# EAGLE schematic MacroBoard (EAGLE 9.6.2)
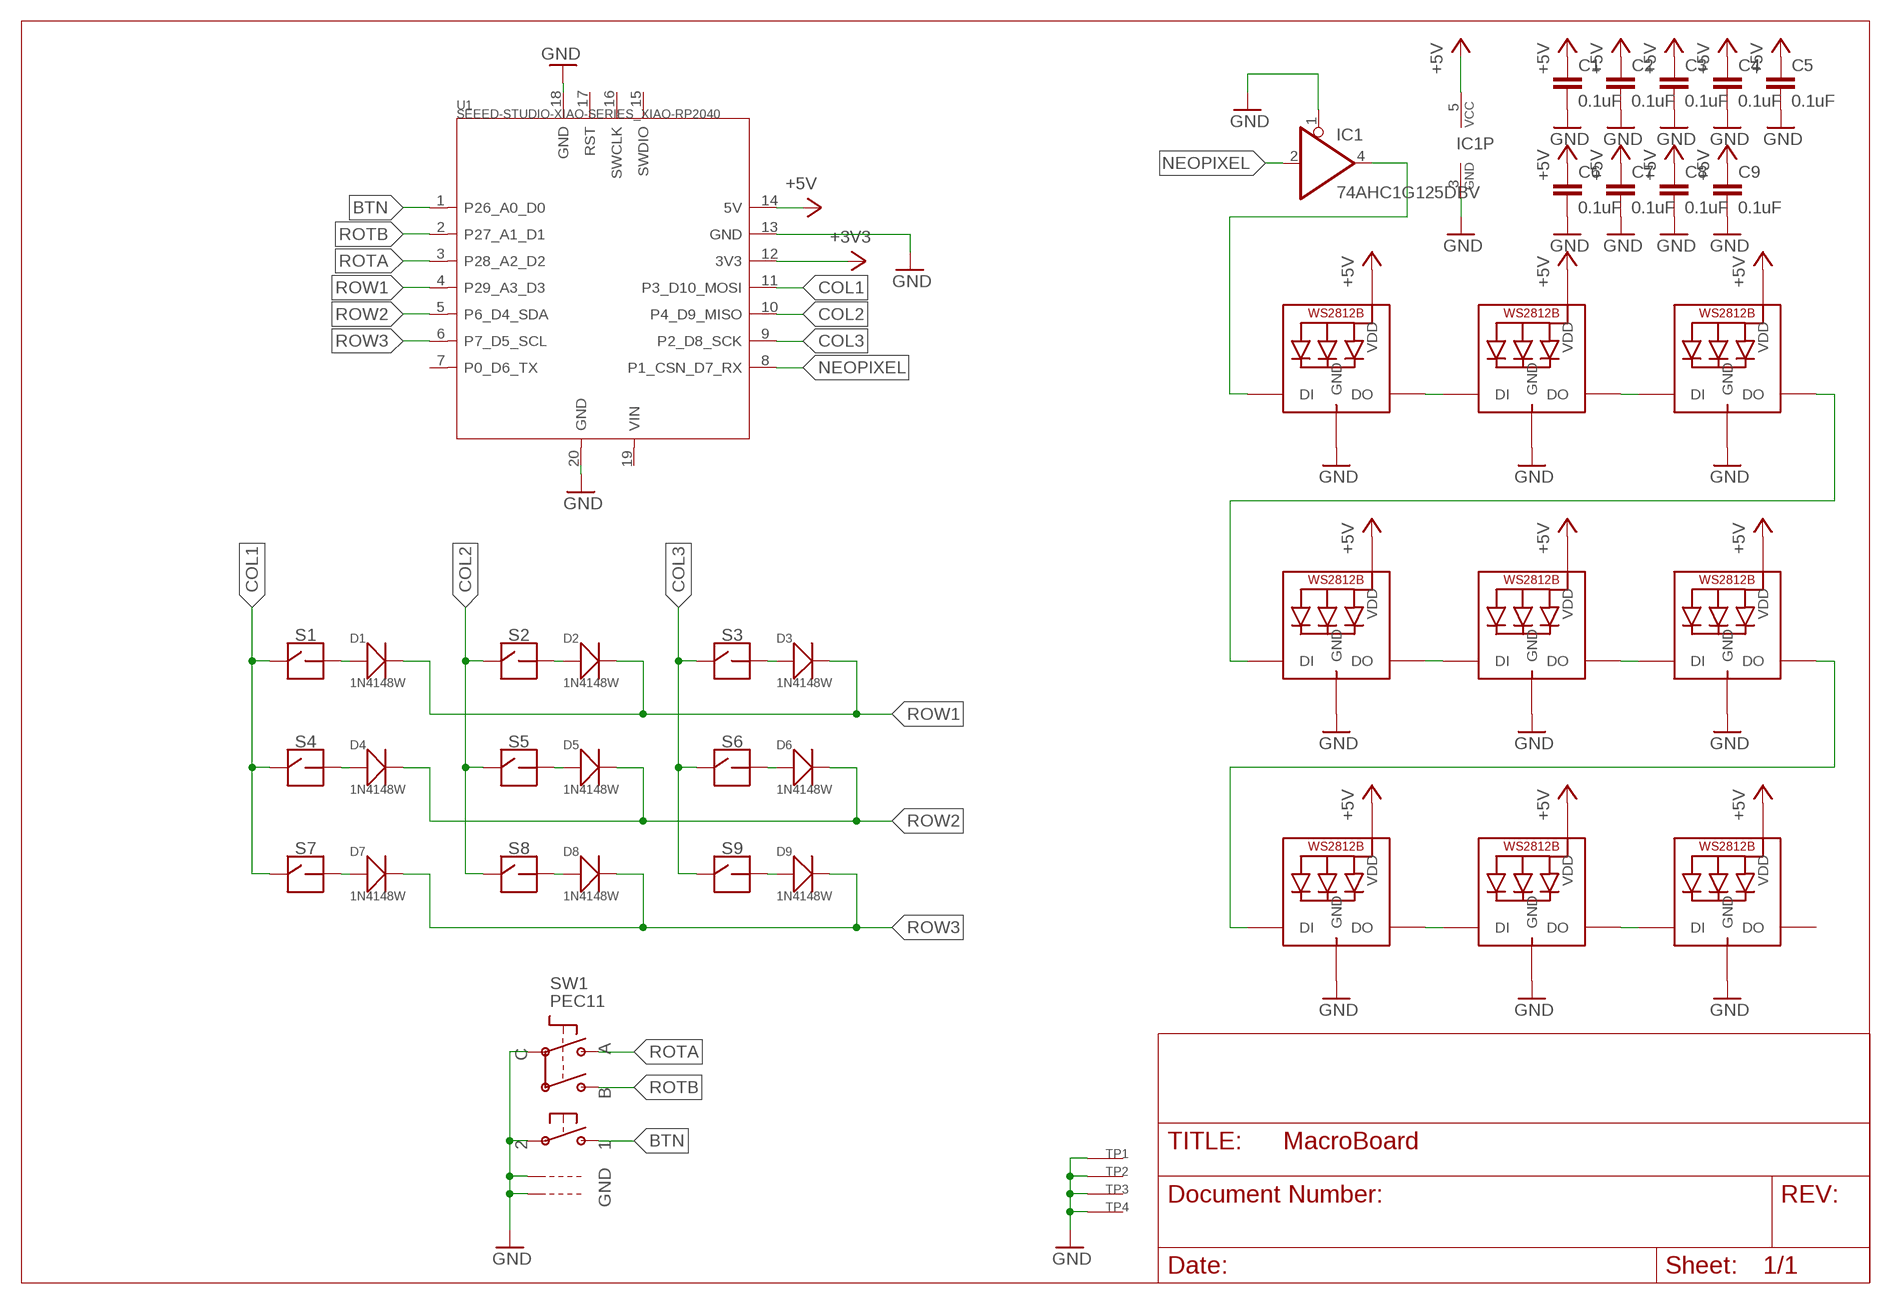
[diagram p0: schematic, sheet 1]

## Parts
C1  0.1uF  C-EUC0805K  [C0805K]
C2  0.1uF  C-EUC0805K  [C0805K]
C3  0.1uF  C-EUC0805K  [C0805K]
C4  0.1uF  C-EUC0805K  [C0805K]
C5  0.1uF  C-EUC0805K  [C0805K]
C6  0.1uF  C-EUC0805K  [C0805K]
C7  0.1uF  C-EUC0805K  [C0805K]
C8  0.1uF  C-EUC0805K  [C0805K]
C9  0.1uF  C-EUC0805K  [C0805K]
D1  1N4148W  SMD-DIODE-SCHOTTKY-20V-1A(SOD-123)  [SOD-123]
D2  1N4148W  SMD-DIODE-SCHOTTKY-20V-1A(SOD-123)  [SOD-123]
D3  1N4148W  SMD-DIODE-SCHOTTKY-20V-1A(SOD-123)  [SOD-123]
D4  1N4148W  SMD-DIODE-SCHOTTKY-20V-1A(SOD-123)  [SOD-123]
D5  1N4148W  SMD-DIODE-SCHOTTKY-20V-1A(SOD-123)  [SOD-123]
D6  1N4148W  SMD-DIODE-SCHOTTKY-20V-1A(SOD-123)  [SOD-123]
D7  1N4148W  SMD-DIODE-SCHOTTKY-20V-1A(SOD-123)  [SOD-123]
D8  1N4148W  SMD-DIODE-SCHOTTKY-20V-1A(SOD-123)  [SOD-123]
D9  1N4148W  SMD-DIODE-SCHOTTKY-20V-1A(SOD-123)  [SOD-123]
IC1  74AHC1G125DBV  [SOT23-5]
LED1  MICROBUILDER_WS2812B_SK6812E  [MICROBUILDER_NEO3535_REVERSE]
LED2  MICROBUILDER_WS2812B_SK6812E  [MICROBUILDER_NEO3535_REVERSE]
LED3  MICROBUILDER_WS2812B_SK6812E  [MICROBUILDER_NEO3535_REVERSE]
LED4  MICROBUILDER_WS2812B_SK6812E  [MICROBUILDER_NEO3535_REVERSE]
LED5  MICROBUILDER_WS2812B_SK6812E  [MICROBUILDER_NEO3535_REVERSE]
LED6  MICROBUILDER_WS2812B_SK6812E  [MICROBUILDER_NEO3535_REVERSE]
LED7  MICROBUILDER_WS2812B_SK6812E  [MICROBUILDER_NEO3535_REVERSE]
LED8  MICROBUILDER_WS2812B_SK6812E  [MICROBUILDER_NEO3535_REVERSE]
LED9  MICROBUILDER_WS2812B_SK6812E  [MICROBUILDER_NEO3535_REVERSE]
S1  SOCKET  ADAFRUIT_ELECTROMECH_KBD_SWITCH_KAILH_SOCKETBOX_JADE_KAILH_SOCKET  [ADAFRUIT_ELECTROMECH_KAILH_SOCKET]
S2  SOCKET  ADAFRUIT_ELECTROMECH_KBD_SWITCH_KAILH_SOCKETBOX_JADE_KAILH_SOCKET  [ADAFRUIT_ELECTROMECH_KAILH_SOCKET]
S3  SOCKET  ADAFRUIT_ELECTROMECH_KBD_SWITCH_KAILH_SOCKETBOX_JADE_KAILH_SOCKET  [ADAFRUIT_ELECTROMECH_KAILH_SOCKET]
S4  SOCKET  ADAFRUIT_ELECTROMECH_KBD_SWITCH_KAILH_SOCKETBOX_JADE_KAILH_SOCKET  [ADAFRUIT_ELECTROMECH_KAILH_SOCKET]
S5  SOCKET  ADAFRUIT_ELECTROMECH_KBD_SWITCH_KAILH_SOCKETBOX_JADE_KAILH_SOCKET  [ADAFRUIT_ELECTROMECH_KAILH_SOCKET]
S6  SOCKET  ADAFRUIT_ELECTROMECH_KBD_SWITCH_KAILH_SOCKETBOX_JADE_KAILH_SOCKET  [ADAFRUIT_ELECTROMECH_KAILH_SOCKET]
S7  SOCKET  ADAFRUIT_ELECTROMECH_KBD_SWITCH_KAILH_SOCKETBOX_JADE_KAILH_SOCKET  [ADAFRUIT_ELECTROMECH_KAILH_SOCKET]
S8  SOCKET  ADAFRUIT_ELECTROMECH_KBD_SWITCH_KAILH_SOCKETBOX_JADE_KAILH_SOCKET  [ADAFRUIT_ELECTROMECH_KAILH_SOCKET]
S9  SOCKET  ADAFRUIT_ELECTROMECH_KBD_SWITCH_KAILH_SOCKETBOX_JADE_KAILH_SOCKET  [ADAFRUIT_ELECTROMECH_KAILH_SOCKET]
SW1  PEC11  ADAFRUIT_ELECTROMECH_ENCODER_PLUS_SWITCH_BOURNS_PEC11  [ADAFRUIT_ELECTROMECH_PEC11+SWITCH]
TP1  SEWTAP_SMTNUTM3  [SMT_NUT_3MM]
TP2  SEWTAP_SMTNUTM3  [SMT_NUT_3MM]
TP3  SEWTAP_SMTNUTM3  [SMT_NUT_3MM]
TP4  SEWTAP_SMTNUTM3  [SMT_NUT_3MM]
U1  SEEED-STUDIO-XIAO-SERIES_XIAO-RP2040  [SEEED-STUDIO-XIAO-SERIES_XIAO-SAMD21/RP2040-MODULE14P-2.54-21X17.8MM]

## Nets
+3V3: U1.12(3V3)
+5V: C1.1 C2.1 C3.1 C4.1 C5.1 C6.1 C7.1 C8.1 C9.1 IC1.5(VCC) LED1.1-VDD(VDD) LED2.1-VDD(VDD) LED3.1-VDD(VDD) LED4.1-VDD(VDD) LED5.1-VDD(VDD) LED6.1-VDD(VDD) LED7.1-VDD(VDD) LED8.1-VDD(VDD) LED9.1-VDD(VDD) U1.14(5V)
BTN: SW1.P$1 U1.1(P26_A0_D0)
COL1: S1.1 S4.1 S7.1 U1.11(P3_D10_MOSI)
COL2: S2.1 S5.1 S8.1 U1.10(P4_D9_MISO)
COL3: S3.1 S6.1 S9.1 U1.9(P2_D8_SCK)
GND: C1.2 C2.2 C3.2 C4.2 C5.2 C6.2 C7.2 C8.2 C9.2 IC1.1(OE) IC1.3(GND) LED1.3-GND(GND) LED2.3-GND(GND) LED3.3-GND(GND) LED4.3-GND(GND) LED5.3-GND(GND) LED6.3-GND(GND) LED7.3-GND(GND) LED8.3-GND(GND) LED9.3-GND(GND) SW1.P$2 SW1.P$C SW1.P$GND1 SW1.P$GND2 TP1.P$1(SEW) TP2.P$1(SEW) TP3.P$1(SEW) TP4.P$1(SEW) U1.13(GND) U1.18(GND) U1.20(GND)
N$1: LED8.2-DOUT(DO) LED9.4-DIN(DI)
N$2: LED7.2-DOUT(DO) LED8.4-DIN(DI)
N$3: LED5.2-DOUT(DO) LED6.4-DIN(DI)
N$4: LED6.2-DOUT(DO) LED7.4-DIN(DI)
N$5: LED4.2-DOUT(DO) LED5.4-DIN(DI)
N$6: LED3.2-DOUT(DO) LED4.4-DIN(DI)
N$7: LED1.2-DOUT(DO) LED2.4-DIN(DI)
N$8: LED2.2-DOUT(DO) LED3.4-DIN(DI)
N$9: IC1.4(O) LED1.4-DIN(DI)
N$13: D1.+ S1.2
N$14: D4.+ S4.2
N$15: D7.+ S7.2
N$16: D2.+ S2.2
N$17: D5.+ S5.2
N$18: D8.+ S8.2
N$19: D3.+ S3.2
N$20: D6.+ S6.2
N$21: D9.+ S9.2
NEOPIXEL: IC1.2(I) U1.8(P1_CSN_D7_RX)
ROTA: SW1.P$A U1.3(P28_A2_D2)
ROTB: SW1.P$B U1.2(P27_A1_D1)
ROW1: D1.- D2.- D3.- U1.4(P29_A3_D3)
ROW2: D4.- D5.- D6.- U1.5(P6_D4_SDA)
ROW3: D7.- D8.- D9.- U1.6(P7_D5_SCL)
Unconnected: LED9.2-DOUT(DO) U1.7(P0_D6_TX) U1.15(SWDIO) U1.16(SWCLK) U1.17(RST) U1.19(VIN)

## Library data of the parts
C1-C9 = rcl:C-EU: CAPACITOR, European symbol; SPICEPREFIX: C
D1-D9 = OPL_Discrete_Semiconductor:SMD-DIODE-SCHOTTKY-20V-1A(SOD-123): 304020034; MPN: B5819W; VALUE: 20V-1A
IC1 = 74xx-little-de:74*1G125: Single Bus Buffer Gate with 3-State Output; SPICEPREFIX: J
LED1-LED9 = MacroBoard:MICROBUILDER_WS2812B
S1-S9 = MacroBoard:ADAFRUIT_ELECTROMECH_KBD_SWITCH_KAILH_SOCKET
SW1 = MacroBoard:ADAFRUIT_ELECTROMECH_ENCODER_PLUS_SWITCH: Rotary Encoder with Built-In Switch PEC11 - 24 Step, PEC11-4215F-S24 - http://www.adafruit.com/products/377
TP1-TP4 = adafruit_electromech:SEWTAP
U1 = MacroBoard:SEEED-STUDIO-XIAO-SERIES_XIAO-RP2040: Seeed Studio XIAO RP2040 v1.22 - Raspberry Pi RP2040 Microcontroller - 32-bit 133MHz Dual-Core ARM® Cortex® M0+processor Seeed SKU: 102010428 Seeed Studio XIAO RP2040 is a microcontroller using the Raspberry Pi RP2040 chip. The MCU runs at up to 133MHz. It is built with rich interfaces in a tiny thumb size and fully supports Arduino, MicroPython, and CircuitPython. The onboard interfaces are enough for developing multiple applications. Buy now <https://www.seeedstudio.com/XIAO-RP2040-v1-0-p-5026.html> Wiki <https://wiki.seeedstudio.com/XIAO-RP2040/>